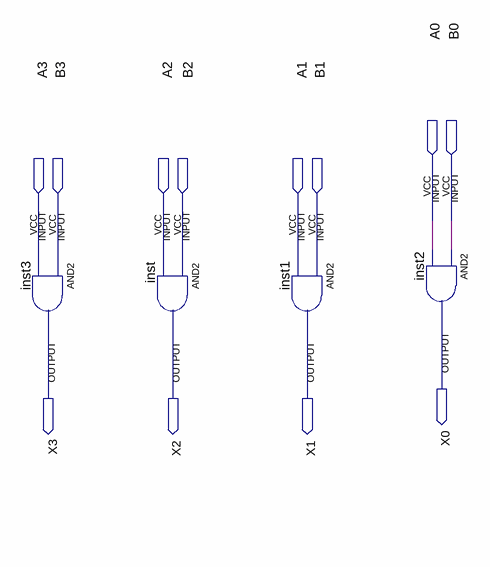
[diagram p0: schematic sheet]
// Quartus schematic 4BitAND.bdf as structural Verilog: 4 symbols, 12 pins
module \4BitAND  (
  input  A0,
  input  B0,
  input  A3,
  input  B3,
  input  A2,
  input  B2,
  input  A1,
  input  B1,
  output X0,
  output X3,
  output X2,
  output X1
);

  and inst3 (X3, B3, A3);
  and inst (X2, B2, A2);
  and inst1 (X1, B1, A1);
  and inst2 (X0, B0, A0);
endmodule
